# EAGLE design LIDAR-Lite-Shield-ArduinoUNO-StepperVersion (EAGLE 9.6.1)
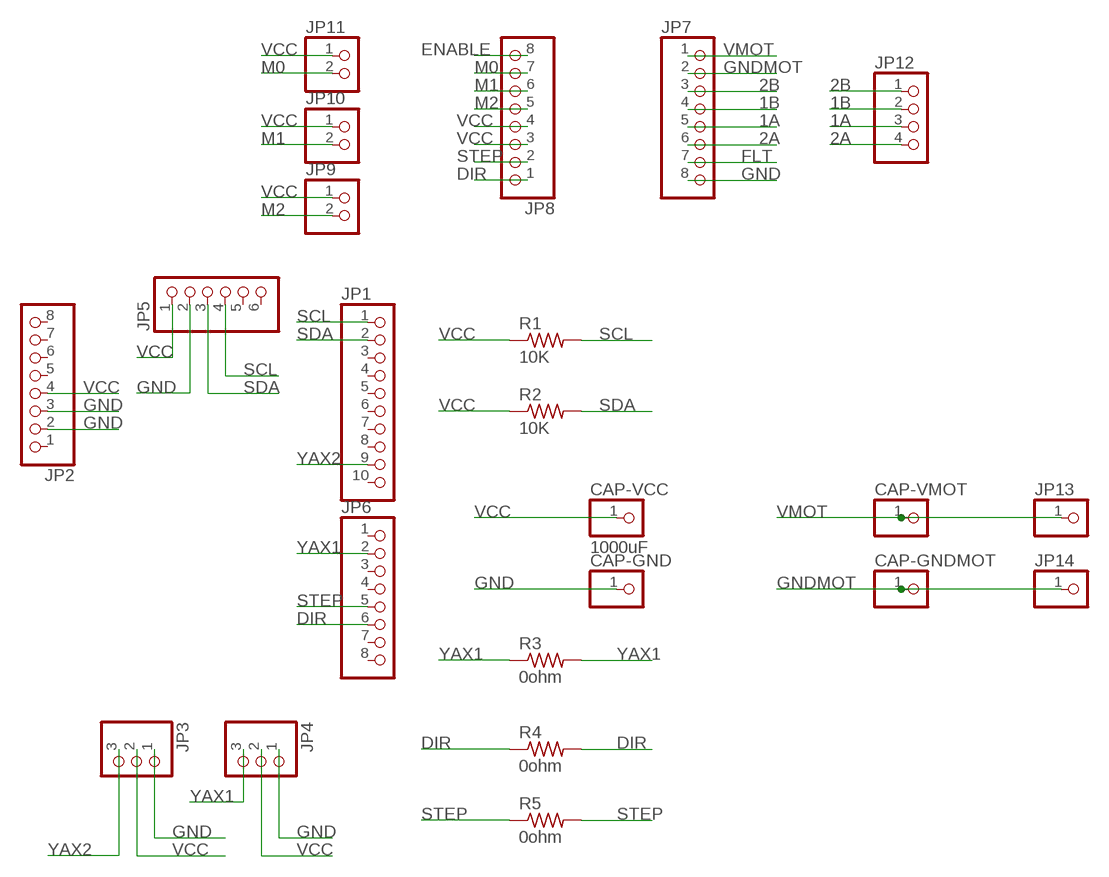
[diagram p0: schematic, sheet 1]

## Parts
CAP-GND  PINHD-1X1  [1X01]
CAP-GNDMOT  PINHD-1X1  [1X01]
CAP-VCC  1000uF  PINHD-1X1  [1X01]
CAP-VMOT  PINHD-1X1  [1X01]
JP1  PINHD-1X10  [1X10]
JP2  PINHD-1X8  [1X08]
JP3  PINHD-1X3  [1X03]
JP4  PINHD-1X3  [1X03]
JP5  PINHD-1X6  [1X06]
JP6  PINHD-1X8  [1X08]
JP7  PINHD-1X8  [1X08]
JP8  PINHD-1X8  [1X08]
JP9  PINHD-1X2  [1X02]
JP10  PINHD-1X2  [1X02]
JP11  PINHD-1X2  [1X02]
JP12  PINHD-1X4  [1X04]
JP13  PINHD-1X1  [1X01]
JP14  PINHD-1X1  [1X01]
R1  10K  RES-US1206FAB  [R1206FAB]
R2  10K  RES-US1206FAB  [R1206FAB]
R3  0ohm  RES-US1206FAB  [R1206FAB]
R4  0ohm  RES-US1206FAB  [R1206FAB]
R5  0ohm  RES-US1206FAB  [R1206FAB]

## Nets
1A: JP7.5 JP12.3
1B: JP7.4 JP12.2
2A: JP7.6 JP12.4
2B: JP7.3 JP12.1
DIR: JP6.6 JP8.1 R4.1 R4.2
ENABLE: JP8.8
FLT: JP7.7
GND: CAP-GND.1 JP2.2 JP2.3 JP3.1 JP4.1 JP5.2 JP7.8
GNDMOT: CAP-GNDMOT.1 JP7.2 JP14.1
M0: JP8.7 JP11.2
M1: JP8.6 JP10.2
M2: JP8.5 JP9.2
SCL: JP1.1 JP5.4 R1.2
SDA: JP1.2 JP5.3 R2.2
STEP: JP6.5 JP8.2 R5.1 R5.2
VCC: CAP-VCC.1 JP2.4 JP3.2 JP4.2 JP5.1 JP8.3 JP8.4 JP9.1 JP10.1 JP11.1 R1.1 R2.1
VMOT: CAP-VMOT.1 JP7.1 JP13.1
YAX1: JP4.3 JP6.2 R3.1 R3.2
YAX2: JP1.9 JP3.3
Unconnected: JP1.3 JP1.4 JP1.5 JP1.6 JP1.7 JP1.8 JP1.10 JP2.1 JP2.5 JP2.6 JP2.7 JP2.8 JP5.5 JP5.6 JP6.1 JP6.3 JP6.4 JP6.7 JP6.8

## Library data of the parts
CAP-GND CAP-GNDMOT CAP-VCC CAP-VMOT JP13 JP14 = pinhead:PINHD-1X1: PIN HEADER
JP1 = pinhead:PINHD-1X10: PIN HEADER
JP2 JP6-JP8 = pinhead:PINHD-1X8: PIN HEADER
JP3 JP4 = pinhead:PINHD-1X3: PIN HEADER
JP5 = pinhead:PINHD-1X6: PIN HEADER
JP9-JP11 = pinhead:PINHD-1X2: PIN HEADER
JP12 = pinhead:PINHD-1X4: PIN HEADER
R1-R5 = fab:RES-US: Resistor (US Symbol) Variants with postfix FAB are widened to allow the routing of internal traces

## Board
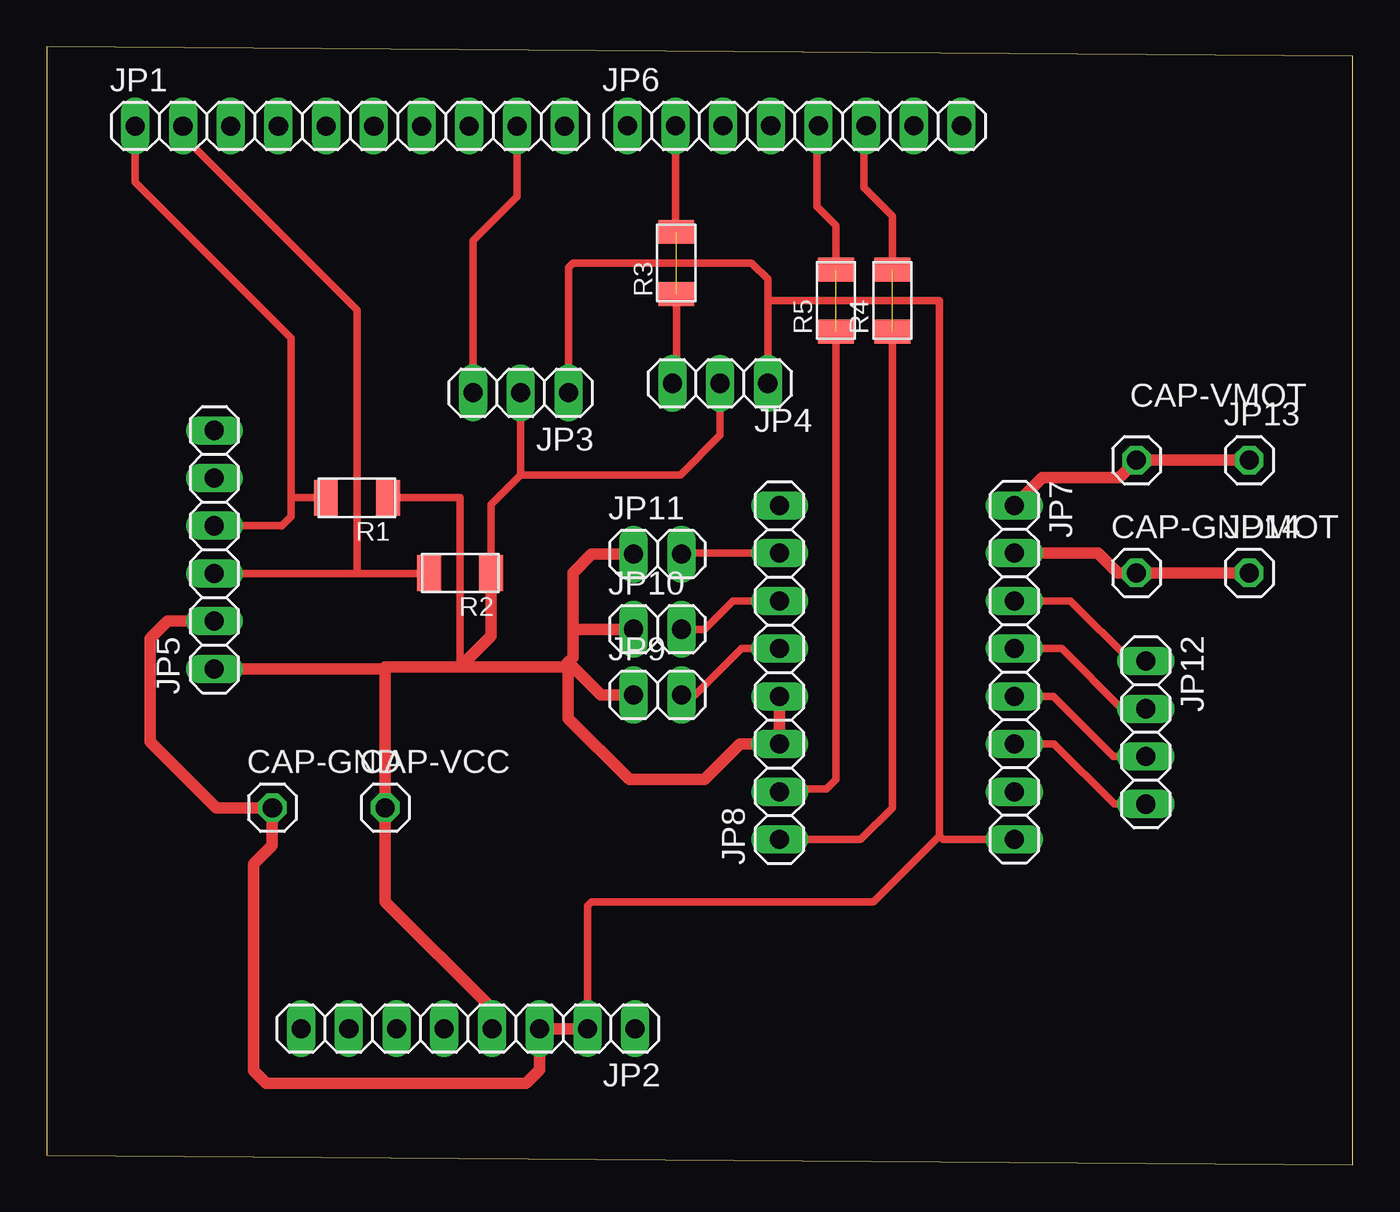
[diagram p1: board, top side]

Size 69.5 x 59.5 mm. Coordinates in mm from the lower left corner, seen from the top.
Outline: 0,0.5 69.5,0 69.5,59 0,59.5 0,0.5
Copper layers (1*16): Top 0.035mm / dielectric 1.5mm / Bottom 0.035mm
Design rules "default *": minimum track width 6mil, minimum drill 0.35mm, track to track 0.4mm, track to pad 0.4mm, pad to pad 0.4mm, via to via 0.4mm, smd to smd 0.4mm, copper to edge 40mil, drill to drill 6mil, minimum pad ring 10mil, minimum via ring 8mil, stop-mask expansion 4mil, vias tented up to drill 0mil, thermal gap 10mil

### Footprints (pad centres in the part's own frame; a part is rotated, then mirrored left to right if it is on the bottom)
1X01 = drill 1.016 octagon: 1 0,0
1X10 = drill 1.016 long: 1 -11.43,0; 2 -8.89,0; 3 -6.35,0; 4 -3.81,0; 5 -1.27,0; 6 1.27,0; 7 3.81,0; 8 6.35,0; 9 8.89,0; 10 11.43,0
1X08 = drill 1.016 long: 1 -8.89,0; 2 -6.35,0; 3 -3.81,0; 4 -1.27,0; 5 1.27,0; 6 3.81,0; 7 6.35,0; 8 8.89,0
1X03 = drill 1.016 long: 1 -2.54,0; 2 0,0; 3 2.54,0
1X06 = drill 1.016 long: 1 -6.35,0; 2 -3.81,0; 3 -1.27,0; 4 1.27,0; 5 3.81,0; 6 6.35,0
1X02 = drill 1.016 long: 1 -1.27,0; 2 1.27,0
1X04 = drill 1.016 long: 1 -3.81,0; 2 -1.27,0; 3 1.27,0; 4 3.81,0
R1206FAB = smd 1.27 x 1.905: 1 -1.651,0; 2 1.651,0

### Placement (x,y rotation side)
CAP-GND  12,19 0 top
CAP-GNDMOT  58,31.5 0 top
CAP-VCC  18,19 0 top
CAP-VMOT  58,37.5 0 top
JP1  16.13,55.29 0 top
JP2  22.42,7.24 180 top
JP3  25.22,41.09 180 top
JP4  35.83,41.59 180 top
JP5  8.91,32.74 90 top
JP6  39.8,55.3 0 top
JP7  51.5,26.2 270 top
JP8  39,26.2 90 top
JP9  32.5,25 0 top
JP10  32.5,28.5 0 top
JP11  32.5,32.5 0 top
JP12  58.5,23 270 top
JP13  64,37.5 0 top
JP14  64,31.5 0 top
R1  16.5,35.5 180 top
R2  22,31.5 180 top
R3  33.5,48 90 top
R4  45,46 90 top
R5  42,46 90 top

### Tracks (layer width: path | path; a pad name or v marks a point on that pad's centre or on a via)
1A
  Top 0.406: JP7.5 53.57,24.93 56.77,21.73 JP12.3
1B
  Top 0.406: JP7.4 54.03,27.47 57.23,24.27 JP12.2
2A
  Top 0.406: JP7.6 53.61,22.39 56.81,19.19 JP12.4
2B
  Top 0.406: JP7.3 54.49,30.01 57.69,26.81 JP12.1
DIR  (1 unrouted)
  Top 0.406: JP8.1 43.31,17.31 45,19 R4.1 | R4.2 45,50.5 43.5,52 43.5,55.19 JP6.6
GND
  Top 0.406: JP3.1 27.76,47.76 28,48 37.5,48 38.37,47.13 38.37,46 | 38.37,46 JP4.1 | 38.37,46 47.5,46 47.5,17.5 | 47.5,17.5 47.69,17.31 JP7.8 | 47.5,17.5 44,14 29,14 28.77,13.77 JP2.2
  Top 0.61: JP5.2 6.43,28.93 5.5,28 5.5,22.5 9,19 CAP-GND.1 12,17 11,16 11,5 11.68,4.32 25.5,4.32 26.23,5.05 JP2.3 JP2.2
GNDMOT
  Top 0.61: JP7.2 55.95,32.55 57,31.5 CAP-GNDMOT.1 JP14.1
M0
  Top 0.406: JP8.7 33.82,32.55 JP11.2
M1
  Top 0.406: JP8.6 36.51,30.01 35,28.5 JP10.2
M2
  Top 0.406: JP8.5 36.97,27.47 34.5,25 JP9.2
SCL
  Top 0.406: JP1.1 4.7,52.3 13,44 13,35.5 | JP5.4 12.49,34.01 12.5,34 13,34.5 13,35.5 | R1.2 13,35.5
SDA
  Top 0.406: JP1.2 7.5,55.03 7.5,54.5 16.5,45.5 16.5,31.47 | 16.5,31.47 20.32,31.47 R2.2 | 16.5,31.47 JP5.3
STEP  (1 unrouted)
  Top 0.406: JP8.2 39.15,20 41.5,20 42,20.5 R5.1 | R5.2 42,50 41,51 41,55.23 JP6.5
VCC
  Top 0.406: R1.1 22,35.5 22,26.5 | R2.1 23.65,35.15 25.22,36.72 | JP3.2 25.22,36.72 | 25.22,36.72 33.72,36.72 35.83,38.83 JP4.2
  Top 0.61: JP2.4 23.69,8.31 18,14 CAP-VCC.1 18,26.39 | JP5.1 18,26.39 | 18,26.39 18,26.5 22,26.5 | 22,26.5 23.65,28.15 R2.1 | 22,26.5 27.5,26.5 27.75,26.75 | 27.75,26.75 28,27 28,28.5 | 28,28.5 28,31.5 29,32.5 JP11.1 | JP10.1 28,28.5 | JP9.1 29.5,25 27.75,26.75 | 27.75,26.75 27.75,23.75 31,20.5 35,20.5 36.89,22.39 JP8.3 JP8.4
VMOT
  Top 0.61: JP7.1 53,36.59 57.09,36.59 CAP-VMOT.1 JP13.1
YAX1  (1 unrouted)
  Top 0.406: R3.2 33.45,49.7 JP6.2 | R3.1 33.5,41.8 JP4.3
YAX2
  Top 0.406: JP3.3 22.68,49.18 25.02,51.52 JP1.9